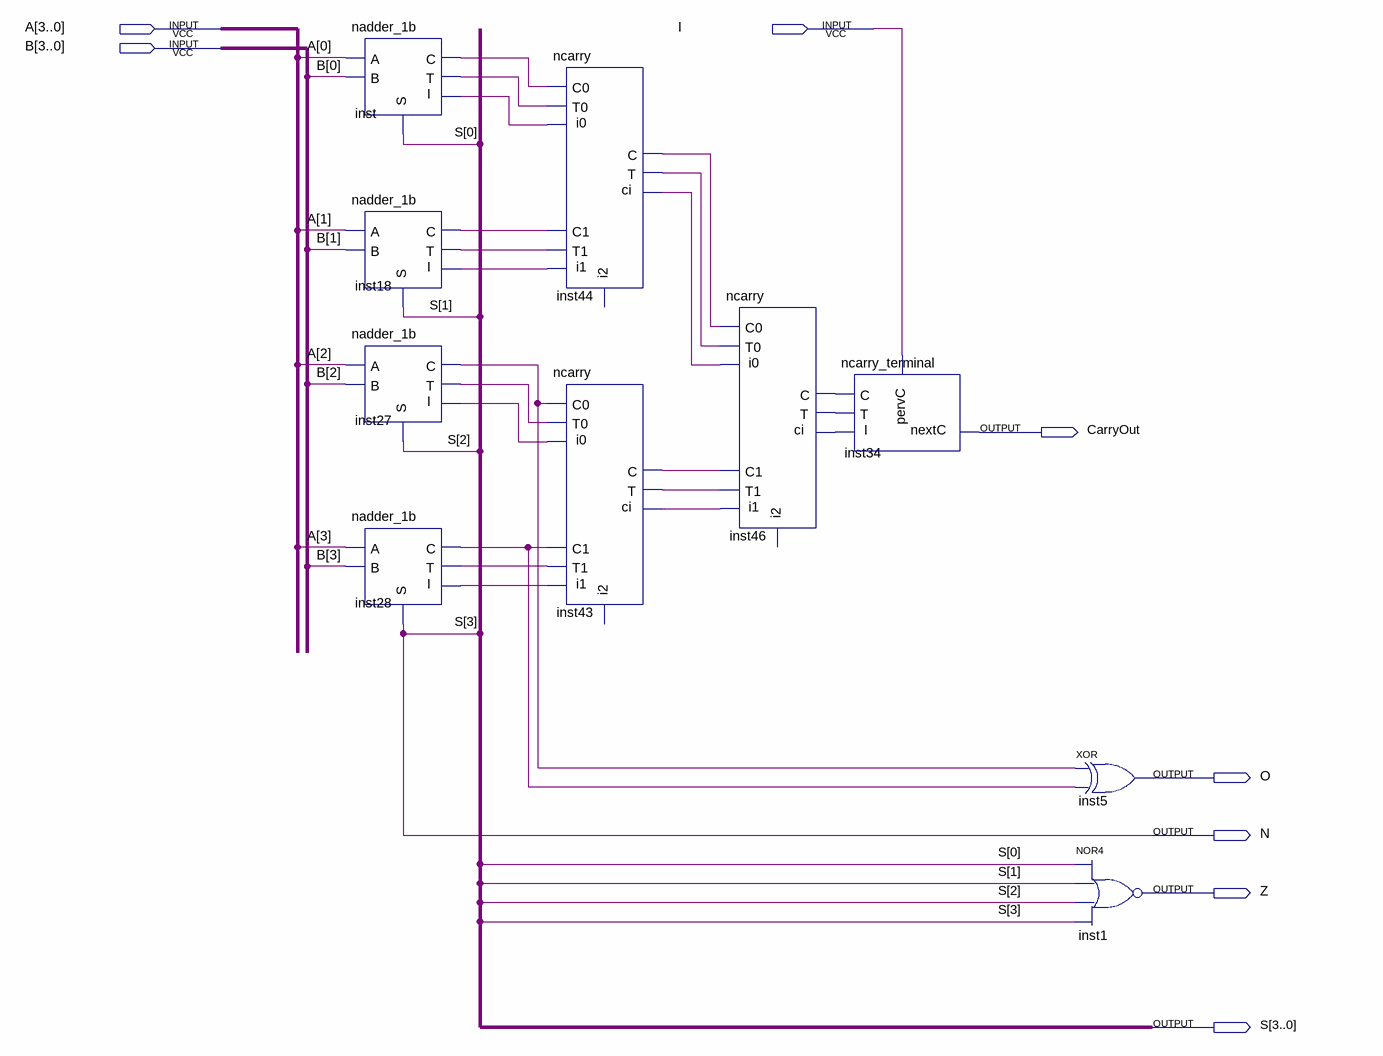
[diagram p0: schematic sheet]
// Quartus schematic nested_adder_4b.bdf as structural Verilog: 10 symbols, 8 pins
module nested_adder_4b (
  input  [3:0] A,
  input  I,
  input  [3:0] B,
  output CarryOut,
  output O,
  output N,
  output Z,
  output [3:0] S
);

  wire inst18_c, inst18_t, inst27_c, inst27_t, inst28_c, inst28_t, inst34_i, inst43_c, inst43_i0, inst43_i1,
       inst43_t, inst44_c, inst44_i0, inst44_i1, inst44_t, inst46_c, inst46_i0, inst46_i1, inst46_t, inst_c,
       inst_t;

  nadder_1b inst (.A(A[0]), .B(B[0]), .I(inst44_i0), .T(inst_t), .S(S[0]), .C(inst_c));
  nadder_1b inst18 (.A(A[1]), .B(B[1]), .I(inst44_i1), .T(inst18_t), .S(S[1]), .C(inst18_c));
  nadder_1b inst27 (.A(A[2]), .B(B[2]), .I(inst43_i0), .T(inst27_t), .S(S[2]), .C(inst27_c));
  nadder_1b inst28 (.A(A[3]), .B(B[3]), .I(inst43_i1), .T(inst28_t), .S(N), .C(inst28_c));
  ncarry inst44 (
    .ci(inst46_i0), .C0(inst_c), .T0(inst_t), .C1(inst18_c), .T1(inst18_t), .i0(inst44_i0), .i1(inst44_i1),
    .T(inst44_t), .C(inst44_c));  // open: i2
  ncarry inst43 (
    .ci(inst46_i1), .C0(inst27_c), .T0(inst27_t), .C1(inst28_c), .T1(inst28_t), .i0(inst43_i0),
    .i1(inst43_i1), .T(inst43_t), .C(inst43_c));  // open: i2
  ncarry inst46 (
    .ci(inst34_i), .C0(inst44_c), .T0(inst44_t), .C1(inst43_c), .T1(inst43_t), .i0(inst46_i0),
    .i1(inst46_i1), .T(inst46_t), .C(inst46_c));  // open: i2
  ncarry_terminal inst34 (.pervC(I), .T(inst46_t), .C(inst46_c), .I(inst34_i), .nextC(CarryOut));
  xor inst5 (O, inst27_c, inst28_c);
  nor inst1 (Z, S[0], S[1], S[2], N);

  assign S[3] = N;
endmodule
